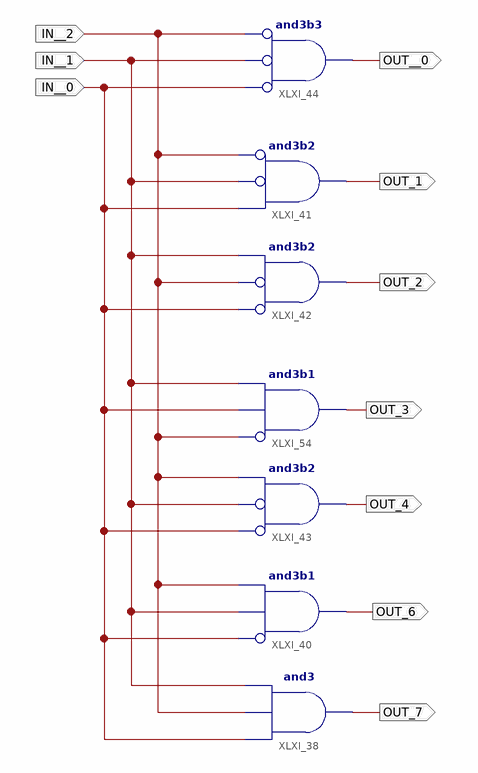
[diagram p0: schematic sheet 1]
// Xilinx ISE schematic decoder3to7.sch (spartan3a) as structural Verilog: 7 symbols, 10 ports
module decoder3to7 (
  input  IN__2,
  input  IN__1,
  input  IN__0,
  output OUT__0,
  output OUT_1,
  output OUT_2,
  output OUT_3,
  output OUT_4,
  output OUT_6,
  output OUT_7
);

  and XLXI_44 (OUT__0, ~IN__0, ~IN__1, ~IN__2);  // and3b3
  and XLXI_42 (OUT_2, ~IN__0, ~IN__2, IN__1);  // and3b2
  and XLXI_41 (OUT_1, ~IN__2, ~IN__1, IN__0);  // and3b2
  and XLXI_43 (OUT_4, ~IN__0, ~IN__1, IN__2);  // and3b2
  and XLXI_40 (OUT_6, ~IN__0, IN__1, IN__2);  // and3b1
  and XLXI_54 (OUT_3, ~IN__2, IN__0, IN__1);  // and3b1
  and XLXI_38 (OUT_7, IN__0, IN__2, IN__1);
endmodule
